# EAGLE design SLA_1500_CAM_V6 (EAGLE 9.2.1)
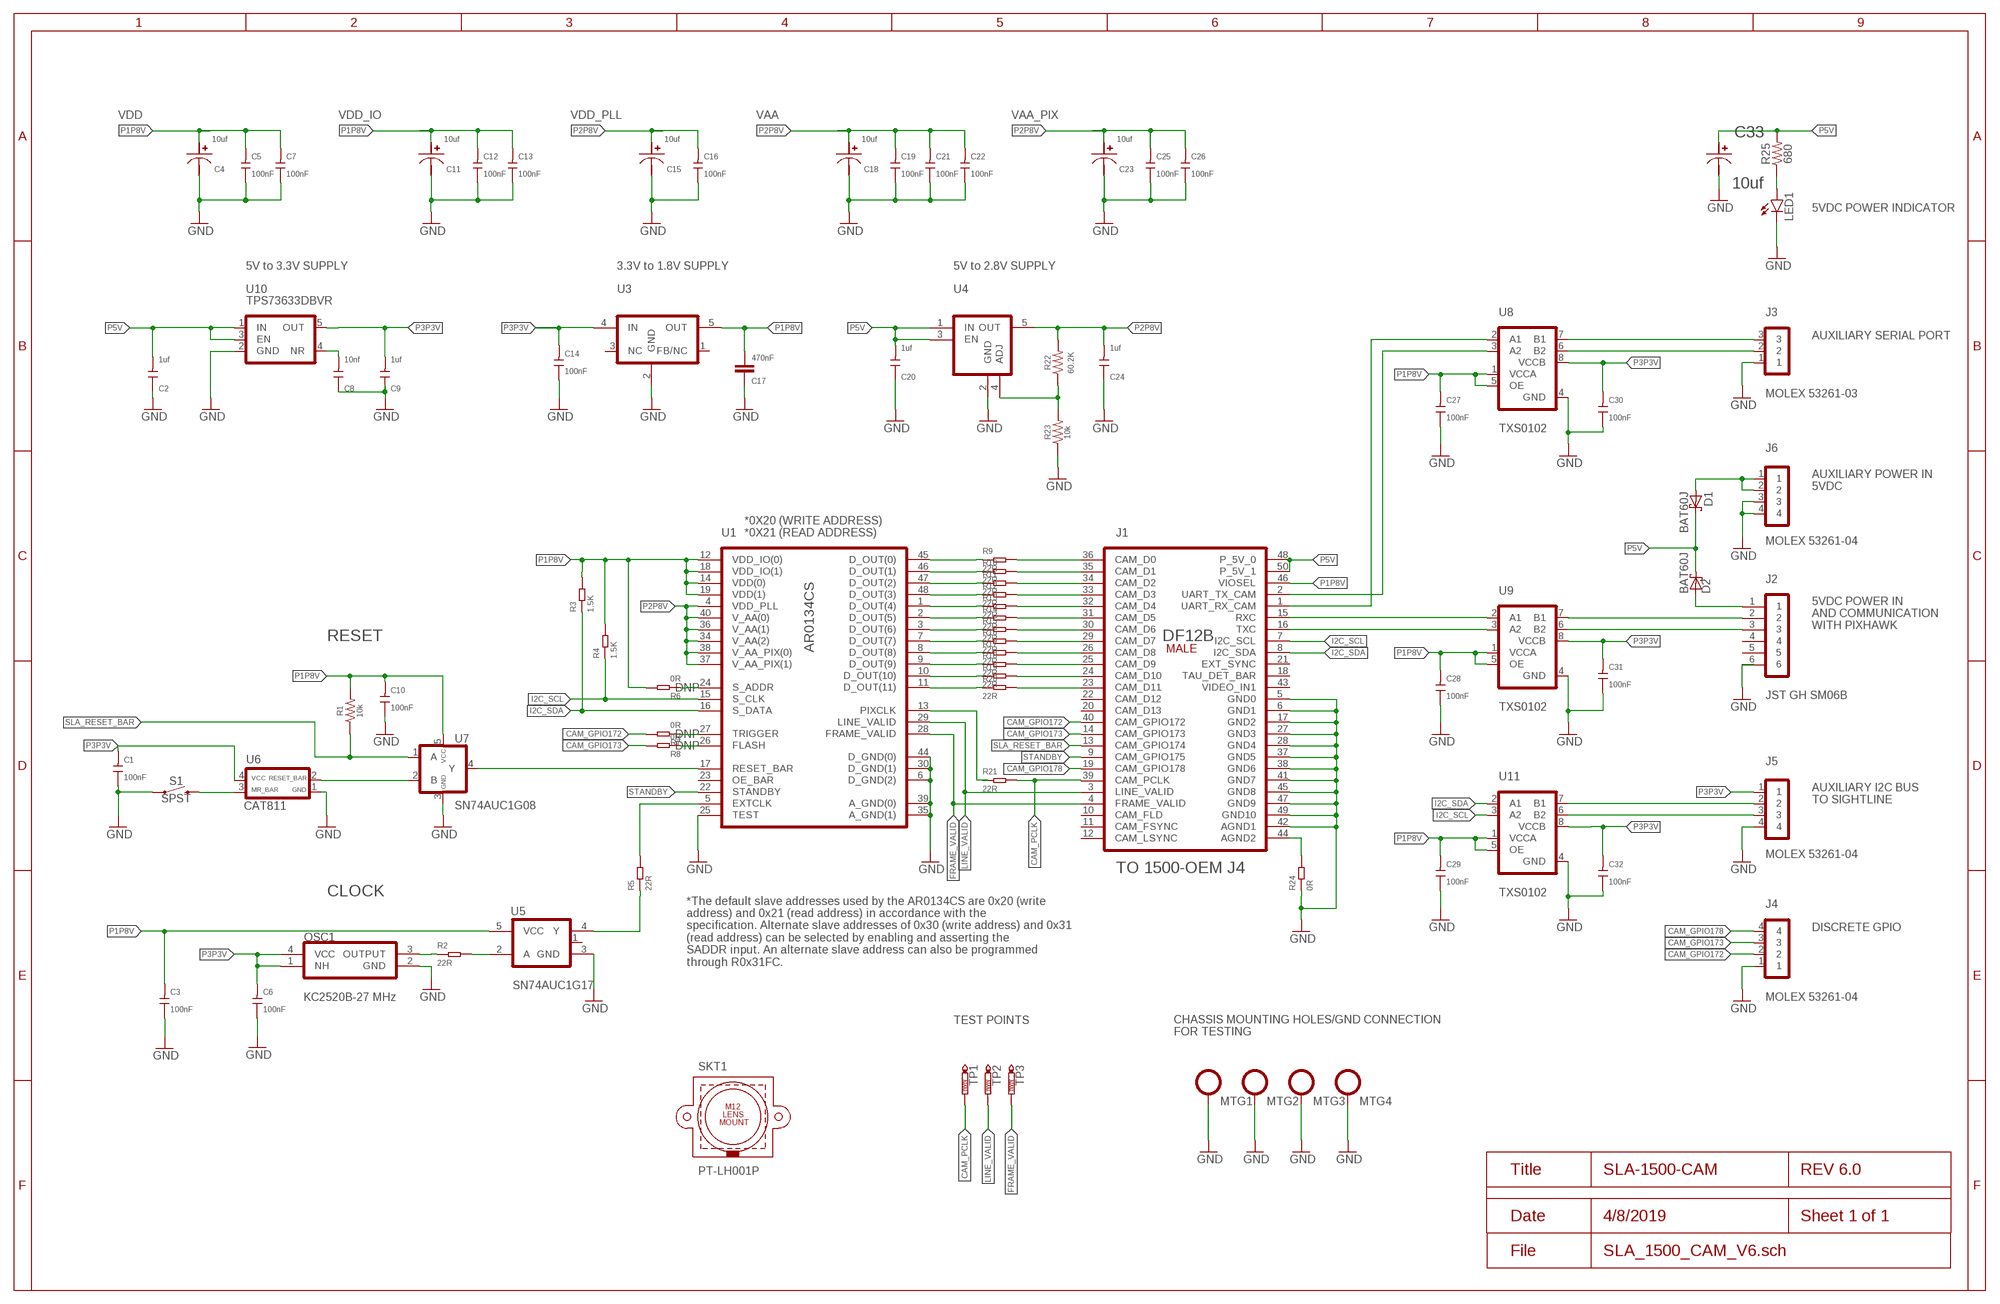
[diagram p0: schematic, sheet 1]
FRAME1 (FRAME_B_L): SPICEPREFIX: X

## Parts
C1  100nF  CERAMIC 100NF-10V-10%-X5R(0402)  [C0402]
C2  1uf  CERAMIC-1UF-10V-10%-X5R(0402)  [C0402]
C3  100nF  CERAMIC 100NF-10V-10%-X5R(0402)  [C0402]
C4  10uf  F980G106MUA  [0402]
C5  100nF  CERAMIC 100NF-10V-10%-X5R(0402)  [C0402]
C6  100nF  CERAMIC 100NF-10V-10%-X5R(0402)  [C0402]
C7  100nF  CERAMIC 100NF-10V-10%-X5R(0402)  [C0402]
C8  10nf  CERAMIC-10NF-50V-10%-X7R(0402)  [C0402]
C9  1uf  CERAMIC-1UF-10V-10%-X5R(0402)  [C0402]
C10  100nF  CERAMIC 100NF-10V-10%-X5R(0402)  [C0402]
C11  10uf  F980G106MUA  [0402]
C12  100nF  CERAMIC 100NF-10V-10%-X5R(0402)  [C0402]
C13  100nF  CERAMIC 100NF-10V-10%-X5R(0402)  [C0402]
C14  100nF  CERAMIC 100NF-10V-10%-X5R(0402)  [C0402]
C15  10uf  F980G106MUA  [0402]
C16  100nF  CERAMIC 100NF-10V-10%-X5R(0402)  [C0402]
C17  470nF  470NF-0402-16V-10%  [0402]
C18  10uf  F980G106MUA  [0402]
C19  100nF  CERAMIC 100NF-10V-10%-X5R(0402)  [C0402]
C20  1uf  CERAMIC-1UF-10V-10%-X5R(0402)  [C0402]
C21  100nF  CERAMIC 100NF-10V-10%-X5R(0402)  [C0402]
C22  100nF  CERAMIC 100NF-10V-10%-X5R(0402)  [C0402]
C23  10uf  F980G106MUA  [0402]
C24  1uf  CERAMIC-1UF-10V-10%-X5R(0402)  [C0402]
C25  100nF  CERAMIC 100NF-10V-10%-X5R(0402)  [C0402]
C26  100nF  CERAMIC 100NF-10V-10%-X5R(0402)  [C0402]
C27  100nF  CERAMIC 100NF-10V-10%-X5R(0402)  [C0402]
C28  100nF  CERAMIC 100NF-10V-10%-X5R(0402)  [C0402]
C29  100nF  CERAMIC 100NF-10V-10%-X5R(0402)  [C0402]
C30  100nF  CERAMIC 100NF-10V-10%-X5R(0402)  [C0402]
C31  100nF  CERAMIC 100NF-10V-10%-X5R(0402)  [C0402]
C32  100nF  CERAMIC 100NF-10V-10%-X5R(0402)  [C0402]
C33  10uf  F980J106MUALZT  [0402]
D1  BAT60J  [SOD323_ST]
D2  BAT60J  [SOD323_ST]
J1  DF12B(5.0)-50DS-0.5(86)SMT  [DF12B(5.0)-50DS-0.5V(86)]
J2  JST GH SM06B  JST_GH_SM06B-GHS-TB  [JST_SM06B-GHS-TB]
J3  MOLEX 53261-03  MOLEX53261-03  [53261-03]
J4  MOLEX 53261-04  MOLEX53261-04  [53261-04]
J5  MOLEX 53261-04  MOLEX53261-04  [53261-04]
J6  MOLEX 53261-04  MOLEX53261-04  [53261-04]
LED1  LEDCHIP-LED0603  [CHIP-LED0603]
MTG1  SLA_MOUNTING  [SLA_MOUNTING]
MTG2  SLA_MOUNTING  [SLA_MOUNTING]
MTG3  SLA_MOUNTING  [SLA_MOUNTING]
MTG4  SLA_MOUNTING  [SLA_MOUNTING]
OSC1  KC2520B-27MHZ  [2.5X2.0_SMDCRYSTAL]
R1  10k  10KOHM-0603-1/10W-1%  [0603]
R2  22R  SMD-RES-22R-1%-1/16W(0402)  [R0402]
R3  1.5K  SMD-RES-1.5K-5%-1/16W(0402)  [R0402]
R4  1.5K  SMD-RES-1.5K-5%-1/16W(0402)  [R0402]
R5  22R  SMD-RES-22R-1%-1/16W(0402)  [R0402]
R6  0R  SMD-RES-0R-5%-1/16W(0402)  [R0402]
R7  0R  SMD-RES-0R-5%-1/16W(0402)  [R0402]
R8  0R  SMD-RES-0R-5%-1/16W(0402)  [R0402]
R9  22R  SMD-RES-22R-1%-1/16W(0402)  [R0402]
R10  22R  SMD-RES-22R-1%-1/16W(0402)  [R0402]
R11  22R  SMD-RES-22R-1%-1/16W(0402)  [R0402]
R12  22R  SMD-RES-22R-1%-1/16W(0402)  [R0402]
R13  22R  SMD-RES-22R-1%-1/16W(0402)  [R0402]
R14  22R  SMD-RES-22R-1%-1/16W(0402)  [R0402]
R15  22R  SMD-RES-22R-1%-1/16W(0402)  [R0402]
R16  22R  SMD-RES-22R-1%-1/16W(0402)  [R0402]
R17  22R  SMD-RES-22R-1%-1/16W(0402)  [R0402]
R18  22R  SMD-RES-22R-1%-1/16W(0402)  [R0402]
R19  22R  SMD-RES-22R-1%-1/16W(0402)  [R0402]
R20  22R  SMD-RES-22R-1%-1/16W(0402)  [R0402]
R21  22R  SMD-RES-22R-1%-1/16W(0402)  [R0402]
R22  60.2K  62KOHM-0603-1/10W-5%  [0603]
R23  10k  10KOHM-0603-1/10W-1%  [0603]
R24  0R  SMD-RES-0R-5%-1/16W(0402)  [R0402]
R25  680  680OHM-0603-1/10W-5%  [0603]
S1  SPST  MOMENTARY-SWITCH-SPST-SMD-4.6X2.8MM  [TACTILE_SWITCH_SMD_4.6X2.8MM]
SKT1  PT-LH001P  M12_LENS_MOUNT  [M12_HOLDER]
TP1  PTR1TP08SQ  [TP08SQ]
TP2  PTR1TP08SQ  [TP08SQ]
TP3  PTR1TP08SQ  [TP08SQ]
U1  AR0134CS-ILCC48  [ILCC48_KD]
U3  TPS71518DCKR  [TI-SC70-5]
U4  AP7331-WG-7  [SOT-25]
U5  SN74AUC1G17  [SOT23-5]
U6  CAT811  [SOT-143-4]
U7  SN74AUC1G08  [SOT23-5]
U8  TXS0102  TXS0102DQM  [X2SON(8)1.8X1.2MM]
U9  TXS0102  TXS0102DQM  [X2SON(8)1.8X1.2MM]
U10  TPS73633DBVR  [SOT23-5]
U11  TXS0102  TXS0102DQM  [X2SON(8)1.8X1.2MM]

## Nets
CAM_GPIO172: J1.40(CAM_GPIO172) J4.2 R7.2
CAM_GPIO173: J1.14(CAM_GPIO173) J4.3 R8.2
CAM_GPIO178: J1.19(CAM_GPIO178) J4.4
CAM_PCLK: J1.39(CAM_PCLK) R21.2 TP1.TP
FRAME_VALID: J1.4(FRAME_VALID) TP3.TP U1.28(FRAME_VALID)
GND: C1.1 C2.1 C3.1 C4.2 C5.1 C6.1 C7.1 C8.1 C9.1 C10.1 C11.2 C12.1 C13.1 C14.1 C15.2 C16.1 C17.2 C18.2 C19.1 C20.1 C21.1 C22.1 C23.2 C24.1 C25.1 C26.1 C27.1 C28.1 C29.1 C30.1 C31.1 C32.1 C33.2 J1.5(GND0) J1.6(GND1) J1.17(GND2) J1.27(GND3) J1.28(GND4) J1.37(GND5) J1.38(GND6) J1.41(GND7) J1.42(AGND1) J1.45(GND8) J1.47(GND9) J1.49(GND10) J2.6 J3.1 J4.1 J5.4 J6.3 J6.4 LED1.C MTG1.P$1 MTG2.P$1 MTG3.P$1 MTG4.P$1 OSC1.2(GND) R23.1 R24.1 S1.1 S1.2 U1.6(D_GND(2)) U1.25(TEST) U1.30(D_GND(1)) U1.35(A_GND(1)) U1.39(A_GND(0)) U1.44(D_GND(0)) U3.2(GND) U4.2(GND) U5.3(GND) U6.1(GND) U7.3(GND) U8.4(GND) U9.4(GND) U10.2(GND) U11.4(GND)
I2C_SCL: J1.7(I2C_SCL) R4.1 U1.15(S_CLK) U11.3(A2)
I2C_SDA: J1.8(I2C_SDA) R3.1 U1.16(S_DATA) U11.2(A1)
LINE_VALID: J1.3(LINE_VALID) TP2.TP U1.29(LINE_VALID)
N$1: J2.3 U9.6(B2)
N$2: R9.1 U1.45(D_OUT(0))
N$3: J1.36(CAM_D0) R9.2
N$4: R10.1 U1.46(D_OUT(1))
N$5: J1.35(CAM_D1) R10.2
N$6: R11.1 U1.47(D_OUT(2))
N$7: J1.34(CAM_D2) R11.2
N$8: R12.1 U1.48(D_OUT(3))
N$9: J1.33(CAM_D3) R12.2
N$10: R13.1 U1.1(D_OUT(4))
N$11: J1.32(CAM_D4) R13.2
N$12: R14.1 U1.2(D_OUT(5))
N$13: J3.3 U8.7(B1)
N$14: J1.31(CAM_D5) R14.2
N$15: R2.2 U5.2(A)
N$16: OSC1.3(OUTPUT) R2.1
N$17: J2.2 U9.7(B1)
N$18: J3.2 U8.6(B2)
N$19: J1.1(UART_RX_CAM) U8.2(A1)
N$20: J1.2(UART_TX_CAM) U8.3(A2)
N$21: C8.2 U10.4(NR)
N$22: R15.1 U1.3(D_OUT(6))
N$23: R22.1 R23.2 U4.4(ADJ)
N$24: J1.30(CAM_D6) R15.2
N$25: R5.1 U5.4(Y)
N$26: R5.2 U1.5(EXTCLK)
N$27: S1.3 S1.4 U6.3(MR_BAR)
N$28: U6.2(RESET_BAR) U7.2(B)
N$29: U1.17(RESET_BAR) U7.4(Y)
N$30: LED1.A R25.1
N$31: J1.44(AGND2) R24.2
N$32: R7.1 U1.27(TRIGGER)
N$33: R8.1 U1.26(FLASH)
N$34: D2.A J2.1
N$35: J1.15(RXC) U9.2(A1)
N$36: J1.16(TXC) U9.3(A2)
N$37: J5.2 U11.7(B1)
N$38: J5.3 U11.6(B2)
N$39: D1.A J6.1 J6.2
N$40: R16.1 U1.7(D_OUT(7))
N$41: J1.29(CAM_D7) R16.2
N$42: R17.1 U1.8(D_OUT(8))
N$43: J1.26(CAM_D8) R17.2
N$44: R18.1 U1.9(D_OUT(9))
N$45: J1.25(CAM_D9) R18.2
N$46: R19.1 U1.10(D_OUT(10))
N$47: J1.24(CAM_D10) R19.2
N$48: R20.1 U1.11(D_OUT(11))
N$49: J1.23(CAM_D11) R20.2
N$52: R6.1 U1.24(S_ADDR)
P1P8V: C3.2 C4.1 C5.2 C7.2 C10.2 C11.1 C12.2 C13.2 C17.1 C27.2 C28.2 C29.2 J1.46(VIOSEL) R1.2 R3.2 R4.2 R6.2 U1.12(VDD_IO(0)) U1.14(VDD(0)) U1.18(VDD_IO(1)) U1.19(VDD(1)) U3.5(OUT) U5.5(VCC) U7.5(VCC) U8.1(VCCA) U8.5(OE) U9.1(VCCA) U9.5(OE) U11.1(VCCA) U11.5(OE)
P2P8V: C15.1 C16.2 C18.1 C19.2 C21.2 C22.2 C23.1 C24.2 C25.2 C26.2 R22.2 U1.4(VDD_PLL) U1.34(V_AA(2)) U1.36(V_AA(1)) U1.37(V_AA_PIX(1)) U1.38(V_AA_PIX(0)) U1.40(V_AA(0)) U4.5(OUT)
P3P3V: C1.2 C6.2 C9.2 C14.2 C30.2 C31.2 C32.2 J5.1 OSC1.1(NH) OSC1.4(VCC) U3.4(IN) U6.4(VCC) U8.8(VCCB) U9.8(VCCB) U10.5(OUT) U11.8(VCCB)
P5V: C2.2 C20.2 C33.1 D1.C D2.C J1.48(P_5V_0) J1.50(P_5V_1) R25.2 U4.1(IN) U4.3(EN) U10.1(IN) U10.3(EN)
PIXCLK: R21.1 U1.13(PIXCLK)
SLA_RESET_BAR: J1.13(CAM_GPIO174) R1.1 U7.1(A)
STANDBY: J1.9(CAM_GPIO175) U1.22(STANDBY)
Unconnected: J1.10(CAM_FLD) J1.11(CAM_FSYNC) J1.12(CAM_LSYNC) J1.18(TAU_DET_BAR) J1.20(CAM_D13) J1.21(EXT_SYNC) J1.22(CAM_D12) J1.43(VIDEO_IN1) J2.4 J2.5 U1.23(OE_BAR) U3.1(FB/NC) U3.3(NC) U5.1(NC)

## Notes on the sheet
- VDD | VDD_IO | VDD_PLL | VAA | VAA_PIX
- 5VDC POWER INDICATOR
- 5V to 3.3V SUPPLY | 3.3V to 1.8V SUPPLY | 5V to 2.8V SUPPLY
- AUXILIARY SERIAL PORT
- AUXILIARY POWER IN
  5VDC
- *0X20 (WRITE ADDRESS)
  *0X21 (READ ADDRESS)
- 5VDC POWER IN 
  AND COMMUNICATION 
  WITH PIXHAWK
- RESET
- DNP
- DNP
- DNP
- AUXILIARY I2C BUS 
  TO SIGHTLINE
- TO 1500-OEM J4
- CLOCK
- DISCRETE GPIO
- *The default slave addresses used by the AR0134CS are 0x20 (write
  address) and 0x21 (read address) in accordance with the
  specification. Alternate slave addresses of 0x30 (write address) and 0x31 
  (read address) can be selected by enabling and asserting the
  SADDR input. An alternate slave address can also be programmed
  through R0x31FC.
- TEST POINTS
- CHASSIS MOUNTING HOLES/GND CONNECTION
  FOR TESTING

## Library data of the parts
C1 C3 C5-C7 C10 C12-C14 C16 C19 C21 C22 C25-C32 = Seeed-Capacitor:CERAMIC 100NF-10V-10%-X5R(0402): 302010037; MPN: CC0402KRX5R6BB104; VALUE: 100NF 10V
C2 C9 C20 C24 = Seeed-Capacitor:CERAMIC-1UF-10V-10%-X5R(0402): 302010040; MPN: CC0402KRX5R6BB105
C4 C11 C15 C18 C23 = Sightline:F980G106MUA: F980G106MUA Tantalum Capacitors - Solid SMD 10uF 4V 20% 0402, 1.1x0.6x0.35mm F98 SERIES DATASHEET <https://www.mouser.com/datasheet/2/40/f98-775787.pdf>; DESCRIPTION: Tantalum Capacitors - Solid SMD 10uF 4V 20% 0402, 1.1x0.6x0.35mm; MANF: AVX; MANF#: F980G106MUA
C8 = Seeed-Capacitor:CERAMIC-10NF-50V-10%-X7R(0402): 302010006; MPN: CC0402KRX7R9BB103
C17 = SparkFun-Capacitors:470NF: 0.47uF/470nF ceramic capacitors A capacitor is a passive two-terminal electrical component used to store electrical energy temporarily in an electric field.; PROD_ID: CAP-09041
C33 = Sightline:F980J106MUALZT: F980G106MUALZT Tantalum Capacitors - Solid SMD 10uF 6.3V 20% 0402, 1.1x0.6x0.35mm F98 SERIES DATASHEET <https://www.mouser.com/datasheet/2/40/f98-775787.pdf>; DESCRIPTION: Tantalum Capacitors - Solid SMD 10uF 6.3V 20% 0402, 1.1x0.6x0.35mm; MANF: AVX; MANF#: F980J106MUALZT
D1 D2 = diode:BAT60J: Schottky barrier diode Source: www.st.com, BAT60J.pdf
J1 = Sightline:DF12B(5.0)-50DS-0.5(86): DF12B(5.0)-50DS-0.5(86) DF12 Series 0.5 mm Pitch SMT Board-to-Board Connector (MALE) Specifications Manufacturer: Hirose Manufacturer Part Number: 537-0309-6 86 Operating Temperature Range(C): -45 - 125 Current Rating: 0.3A Voltage Rating: 50V AC Body Size(mm): 14.6 x 3.6 DF12B(5.0)-50DS DATASHEET <https://www.hirose.com/product/en/products/DF12/> Created by: Kimball S. Davis kimball4@pdx.edu <mailto: kimball4@pdx.edu> 21 January 2019 Version 001; DESCRIPTION: DF12B-50DS-0.5V(86) Hirose Male 50-pin connector; MANF: Hirose; MANF#: 537-0309-6 86
J2 = Sightline:JST_GH_SM06B-GHS-TB: JST SM06B-GHS-TB JST Type GH 1.25mm side-entry smt 6-pin connector Specifications Manufacturer: JST Manufacturer Part Number: SM06B-GHS-TB Body Size(mm): 10.75 X 4.25 JST TYPE GH DATASHEET <http://www.jst-mfg.com/product/pdf/eng/eGH.pdf> Created by: Kimball S. Davis 5 February 2019 Version 001; DESCRIPTION: 1.25 MM SIDE-ENTRY 6-PIN SMT CONNECTOR; MANF: JST; MANF#: SM06B-GHS-TB
J3 = Sightline:MOLEX53261-03: MOLEX 53261-03 1.25mm Pitch PicoBlade Header, Surface Mount, Right-Angle, 3 Circuits, Tin (Sn) Plating 53261-03 DATASHEET <https://www.molex.com/webdocs/datasheets/pdf/en-us/0532610371_PCB_HEADERS.pdf>; DESCRIPTION: 1.25mm Pitch PicoBlade Header, Surface Mount, Right-Angle, 3 Circuits, Tin (Sn) Plating; MANF: MOLEX; MANF#: 532610371
J4-J6 = Sightline:MOLEX53261-04: MOLEX 53261-04 1.25mm Pitch PicoBlade Header, Surface Mount, Right-Angle, 4 Circuits, Tin (Sn) Plating 53261-04 DATASHEET <https://www.molex.com/webdocs/datasheets/pdf/en-us/0532610471_PCB_HEADERS.pdf>; DESCRIPTION: 1.25mm Pitch PicoBlade Header, Surface Mount, Right-Angle, 4 Circuits, Tin (Sn) Plating; MANF: MOLEX; MANF#: 532610471
LED1 = led:LED: LED OSRAM: - CHIPLED LG R971, LG N971, LY N971, LG Q971, LY Q971, LO R971, LY R971 LH N974, LH R974 LS Q976, LO Q976, LY Q976 LO Q996 - Hyper CHIPLED LW Q18S LB Q993, LB Q99A, LB R99A - SideLED LS A670, LO A670, LY A670, LG A670, LP A670 LB A673, LV A673, LT A673, LW A673 LH A674 LY A675 LS A676, LA A676, LO A676, LY A676, LW A676 LS A679, LY A679, LG A679 - Hyper Micro SIDELED® LS Y876, LA Y876, LO Y876, LY Y876 LT Y87S - SmartLED LW L88C, LW L88S LB L89C, LB L89S, LG L890 LS L89K, LO L89K, LY L89K LS L896, LA L896, LO L896, LY L896 - TOPLED LS T670, LO T670, LY T670, LG T670, LP T670 LSG T670, LSP T670, LSY T670, LOP T670, LYG T670 LG T671, LOG T671, LSG T671 LB T673, LV T673, LT T673, LW T673 LH T674 LS T676, LA T676, LO T676, LY T676, LB T676, LH T676, LSB T676, LW T676 LB T67C, LV T67C, LT T67C, LS T67K, LO T67K, LY T67K, LW E67C LS E67B, LA E67B, LO E67B, LY E67B, LB E67C, LV E67C, LT E67C LW T67C LS T679, LY T679, LG T679 LS T770, LO T770, LY T770, LG T770, LP T770 LB T773, LV T773, LT T773, LW T773 LH T774 LS E675, LA E675, LY E675, LS T675 LS T776, LA T776, LO T776, LY T776, LB T776 LHGB T686 LT T68C, LB T68C - Hyper Mini TOPLED® LB M676 - Mini TOPLED Santana® LG M470 LS M47K, LO M47K, LY M47K Source: http://www.osram.convergy.de LUXEON: - LUMILED® LXK2-PW12-R00, LXK2-PW12-S00, LXK2-PW14-U00, LXK2-PW14-V00 LXK2-PM12-R00, LXK2-PM12-S00, LXK2-PM14-U00 LXK2-PE12-Q00, LXK2-PE12-R00, LXK2-PE12-S00, LXK2-PE14-T00, LXK2-PE14-U00 LXK2-PB12-K00, LXK2-PB12-L00, LXK2-PB12-M00, LXK2-PB14-N00, LXK2-PB14-P00, LXK2-PB14-Q00 LXK2-PR12-L00, LXK2-PR12-M00, LXK2-PR14-Q00, LXK2-PR14-R00 LXK2-PD12-Q00, LXK2-PD12-R00, LXK2-PD12-S00 LXK2-PH12-R00, LXK2-PH12-S00 LXK2-PL12-P00, LXK2-PL12-Q00, LXK2-PL12-R00 Source: www.luxeon.com KINGBRIGHT: KA-3528ASYC Source: www.kingbright.com
MTG1-MTG4 = Sightline:SLA_MOUNTING
OSC1 = Sightline:KC2520B-27MHZ: KC2520B-27MHz-2.5X2.0 27 MHz SMT Clock Oscillator with CMOS output Specifications Manufacturer: Kyocera Manufacturer Part Number: KC2520B27.0000C2GE00 Supply Voltage: 1.8 to 3.3V Body Size(mm): 2.5 x 2.0 KC2520B DATASHEET <https://www.mouser.com/datasheet/2/909/kc2520b_c1_e-1388834.pdf> Created by: Kimball S. Davis 25 January 2019 Version 001; DESCRIPTION: OSC, CRYSTAL CLOCK, SMD, CMOS, 2.25V TO 3.63V, 4mA, 27.0000MHz, 2.5MM x 2.0MM; MANF: Kyocera; MANF#: KC2520B27.0000C2GE00
R1 R23 = SparkFun-Resistors:10KOHM: 10kΩ resistor A resistor is a passive two-terminal electrical component that implements electrical resistance as a circuit element. Resistors act to reduce current flow, and, at the same time, act to lower voltage levels within circuits. - Wikipedia; PROD_ID: RES-00824
R2 R5 R9-R21 = Seeed-Resistor:SMD-RES-22R-1%-1/16W(0402): 301010052; MPN: RC0402FR-0722RL
R3 R4 = Seeed-Resistor:SMD-RES-1.5K-5%-1/16W(0402): 301010001; MPN: RC0402JR-071K5L
R6-R8 R24 = Seeed-Resistor:SMD-RES-0R-5%-1/16W(0402): 301010000; MPN: RC0402JR-070RL
R22 = SparkFun-Resistors:62KOHM: 62kΩ resistor A resistor is a passive two-terminal electrical component that implements electrical resistance as a circuit element. Resistors act to reduce current flow, and, at the same time, act to lower voltage levels within circuits. - Wikipedia
R25 = SparkFun-Resistors:680OHM: 680Ω resistor A resistor is a passive two-terminal electrical component that implements electrical resistance as a circuit element. Resistors act to reduce current flow, and, at the same time, act to lower voltage levels within circuits. - Wikipedia; PROD_ID: RES-09333
S1 = SparkFun-Switches:MOMENTARY-SWITCH-SPST: Momentary Switch (Pushbutton) - SPST Normally-open (NO) SPST momentary switches (buttons, pushbuttons). Variants PTH-12MM - 12mm square, through-hole Momentary Pushbutton Switch - 12mm Square <https://www.sparkfun.com/products/9190> (COM-09190) PTH-6.0MM, PTH-6.0MM-KIT - 6.0mm square, through-hole Mini Pushbutton Switch <https://www.sparkfun.com/products/97> (COM-00097) KIT package intended for soldering kit's - only one side of pads' copper is exposed. PTH-RIGHT-ANGLE-KIT - Right-angle, through-hole Right Angle Tactile Button <https://www.sparkfun.com/products/10791> - Used on SparkFun BigTime Watch Kit <https://www.sparkfun.com/products/11734> SMD-12MM - 12mm square, surface-mount Tactile Button - SMD (12mm) <https://www.sparkfun.com/products/12993> (COM-12993) Used on SparkFun PicoBoard <https://www.sparkfun.com/products/11888> SMD-4.5MM - 4.5mm Square Trackball Switch Used on SparkFun Blackberry Trackballer Breakout <https://www.sparkfun.com/products/13169> SMD-4.6MMX2.8MM - 4.60mm x 2.80mm, surface mount Used on SparkFun SAMD21 Mini Breakout <https://www.sparkfun.com/products/13664> SMD-5.2MM, SMD-5.2-REDUNDANT - 5.2mm square, surface-mount Mini Pushbutton Switch - SMD <https://www.sparkfun.com/products/8720> (COM-08720) Used on Arduino Pro Mini <https://www.sparkfun.com/products/11114> REDUNDANT package connects both switch circuits together SMD-6.0X3.5MM - 6.0 x 3.5mm, surface mount Momentary Reset Switch SMD <https://www.sparkfun.com/products/8229> (COM-08229) SMD-6.2MM-TALL - 6.2mm square, surface mount Tactile Button - SMD (6mm) <https://www.sparkfun.com/products/12992> Used on SparkFun Digital Sandbox <https://www.sparkfun.com/products/12651> SMD-RIGHT-ANGLE - Right-angle, surface mount Used on SparkFun Block for Intel® Edison - Arduino <https://www.sparkfun.com/products/13036>; PROD_ID: SWCH-13065
SKT1 = Sightline:M12_LENS_MOUNT: PT-LH001P PT-LH001P Plastic M12 Lens Holder, 20mm Hole Spacing; DESCRIPTION: PT-LH001P Plastic M12 Lens Holder, 20mm Hole Spacing; MANF: M12 LENSES; MANF#: PT-LH001P
TP1-TP3 = testpad:PTR1: TEST PIN
U1 = Sightline:AR0134CS-ILCC48: AR0134CS-1LCC48-10x10 1/3-inch 1.2 Mp CMOS digital image sensor with an active-pixel array of 1280 (H) × 960 (V) Specifications Manufacturer: On Semiconductor Manufacturer Part Number: AR0134CSSM00SPCA0 Operating Temperature Range(C): -30 - 70 Supply Voltage: I/O: 1.8 or 2.8V Digital: 1.8V Analog: 2.8V HiSPi: 0.4V Body Size(mm): 10 x 10 ARO134CS DATASHEET <https://www.onsemi.com/pub/Collateral/AR0134CS-D.PDF> Created by: Kimball S. Davis kimball4@pdx.edu <mailto: kimball4@pdx.edu> 22 January 2019 Version 001; DESCRIPTION: 1/3-inch 1.2 Mp CMOS digital image sensor with an active-pixel array of 1280 (H) × 960 (V); MANF: On Semiconductor; MANF#: AR0134CSSM00SPCA0
U3 = Sightline:TPS71518DCKR: TPS71518DCKR 50-mA, 24-V, 3.2-μA Supply Current Low-Dropout Linear Regulator in SC70 5-Pin Package, 3.3 to 1.8V, 2.15 x 1.4mm TPS71518DCKR DATASHEET <http://www.ti.com/lit/ds/symlink/tps715.pdf>; DESCRIPTION: 50-mA, 24-V, 3.2-μA Supply Current Low-Dropout Linear Regulator in SC70 5-Pin Package, 3.3 to 1.8V, 2.15 x 1.4mm; MANF: TEXAS INSTRUMENTS; MANF#: TPS71518DCKR
U4 = Sightline:AP7331-WG-7: AP7331-WG-7 300mA, LOW QUIESCENT CURRENT, FAST TRANSIENT LOW DROPOUT LINEAR REGULATOR, ADJUSTABLE OUTPUT, 5V to 2.8V, 3.1 x 1.7mm AP7331 DATASHEET <https://www.diodes.com/assets/Datasheets/AP7331.pdf>; DESCRIPTION: 300mA, LOW QUIESCENT CURRENT, FAST TRANSIENT LOW DROPOUT LINEAR REGULATOR, ADJUSTABLE OUTPUT, 5V to 2.8V, 3.1 x 1.7mm; MANF: DIODES INCORPORATED; MANF#: AP7331-WG-7
U5 = Sightline:SN74AUC1G17: SN74AUC1G17-SOT23-5 IC, BUFFER, SINGLE SCHMITT-TRIGGER, 9mA, 0.8V TO 2.7V, SOT23-5 Specifications Manufacturer: Texas Instruments Manufacturer Part Number: SN74AUC1G17DBVR Supply Voltage: 3.6V Max Body Size(mm): 2.9 x 1.6 SN74AUC1G17 DATASHEET <http://www.ti.com/lit/ds/symlink/sn74auc1g17.pdf> Created by: Kimball S. Davis 24 January 2019 Version 001; DESCRIPTION: IC, BUFFER, SINGLE SCHMITT-TRIGGER, 9mA, 0.8V TO 2.7V, SOT23-5; MANF: TEXAS INSTRUMENTS; MANF#: SN74AUC1G17DBV
U6 = Sightline:CAT811: CAT811-SOT-143-4 IC, SUPERVISOR, MICROPROCESSOR POWER SUPPLY, 2.93V, ACTIVE LOW RESET, SOT143-4 Specifications Manufacturer: On Semiconductor Manufacturer Part Number: CAT811STBI Body Size(mm): 2.9 x 1.3 CAT811 DATASHEET <https://www.onsemi.com/pub/Collateral/CAT811-D.PDF> Created by: Kimball S. Davis 23 January 2019 Version 001; DESCRIPTION: IC, SUPERVISOR, MICROPROCESSOR POWER SUPPLY, 2.93V, ACTIVE LOW RESET, SOT143-4; MANF: On Semiconductor; MANF#: CAT811STBI
U7 = Sightline:SN74AUC1G08: SN74AUC1G08-SOT23-5 Single 2-Input Positive-AND Gate Specifications Manufacturer: Texas Instruments Manufacturer Part Number: SN74AUC1G08DBVR Supply Voltage: 1.65 - 1.95V Body Size(mm): 2.9 x 1.6 SN74AUC1G08 DATASHEET <http://www.ti.com/lit/ds/symlink/sn74auc1g08.pdf>; DESCRIPTION: IC, AND GATE, SINGLE, 2 INPUT POSITIVE, SGL, SOT23-5; MANF: Texas Instruments; MANF#: SN74AUC1G08DBVR
U8 U9 U11 = Sightline:TXS0102DQM: TXS0102DQM 1.8 X 1.2 mm TXS0102 2-Bit Bidirectional Voltage-Level Translator TXS0102 DATASHEET <http://www.ti.com/lit/ds/symlink/txs0102.pdf>; DESCRIPTION: TXS0102 2-Bit Bidirectional Voltage-Level Translator for Open-Drain and Push-Pull Applications; MANF: Texas Instruments; MANF#: TXS0102DQM
U10 = Sightline:TPS73633DBVR: TPS73633DBVR Cap-Free, NMOS, 400-mA Low-Dropout Regulator with Reverse Current Protection 5.5 to 3.3V, SOT-23 5-pin, 2.9 x 1.6 mm TPS73633DBVR DATASHEET <http://www.ti.com/lit/ds/symlink/tps736.pdf>; DESCRIPTION: Cap-Free, NMOS, 400-mA Low-Dropout Regulator with Reverse Current Protection 5.5 to 3.3V, SOT-23 5-pin, 2.9 x 1.6 mm; MANF: Texas Instruments; MANF#: TPS73633DBVR

## Board
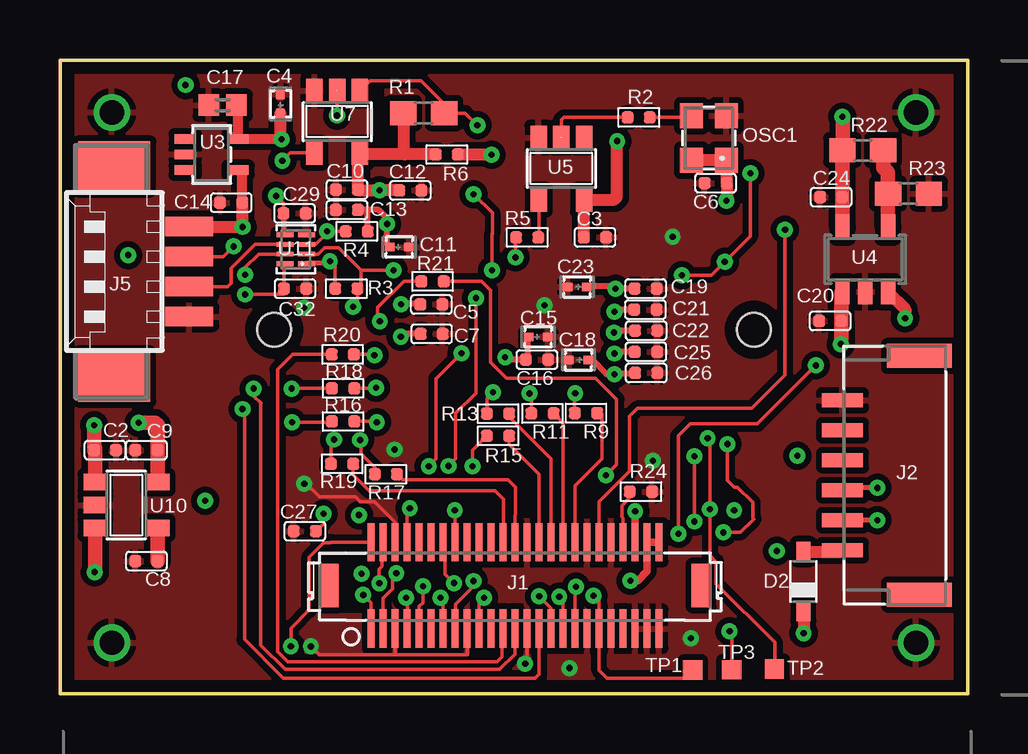
[diagram p1: board, top side]
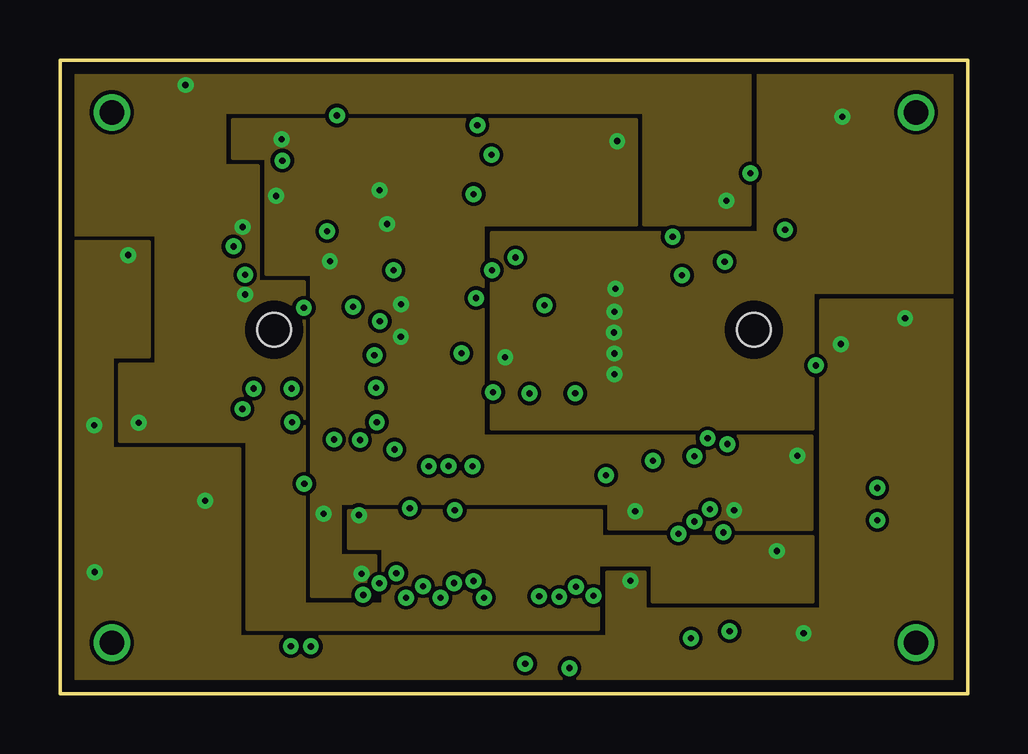
[diagram p2: board, inner layer Route2]
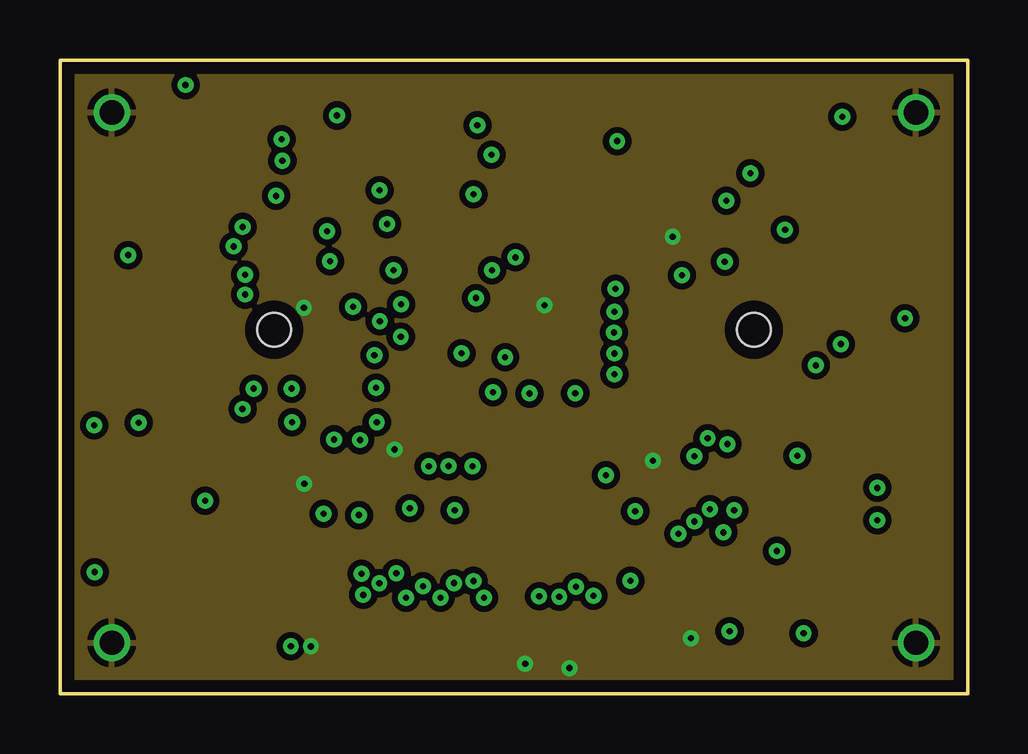
[diagram p3: board, inner layer Route15]
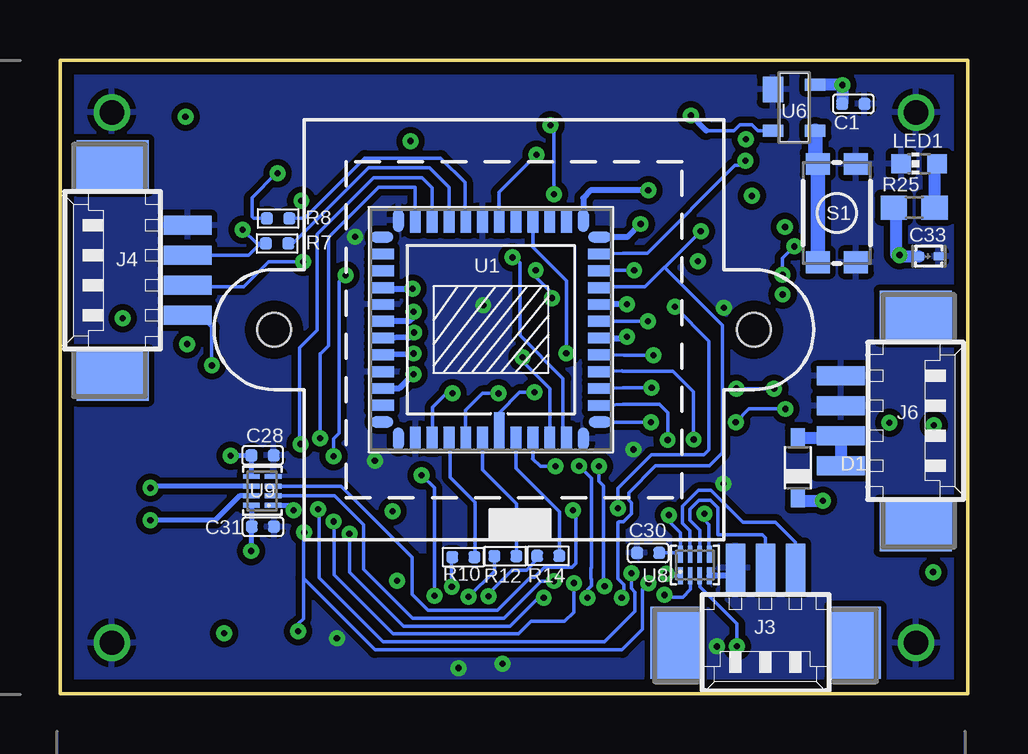
[diagram p4: board, bottom side, seen from below]

Size 37.85 x 26.42 mm. Coordinates in mm from the lower left corner, seen from the top.
Outline: 0,0 0.18,0
Outline: 0.18,0 37.85,0 37.85,26.42 0,26.42 0,0
Outline: 0,0 0.18,0
Copper layers (1+2*15+16): Top 0.0178mm / dielectric 12mil / Route2 0.0356mm / dielectric 28mil / Route15 0.0356mm / dielectric 12mil / Bottom 0.0178mm
Design rules "SSC-EAGLE-4Lyr_v1.0.0.3 *": minimum track width 6mil, minimum drill 8mil, track to track 6mil, track to pad 6mil, pad to pad 6mil, via to via 6mil, smd to smd 6mil, copper to edge 20mil, drill to drill 16mil, minimum pad ring 8mil, minimum via ring 8mil, stop-mask expansion 3mil, vias tented up to drill 12mil, thermal gap 10mil

### Footprints (pad centres in the part's own frame; a part is rotated, then mirrored left to right if it is on the bottom)
C0402 = smd 0.5 x 0.5: 1 0,0.463; 2 0,-0.463
0402 = smd 0.4 x 0.35: 1 -0.4,0; 2 0.4,0
0402' = smd 0.85 x 0.9: 1 -0.58,0; 2 0.58,0
SOD323_ST = smd 0.8 x 0.6: A 1.25,0; C -1.25,0
DF12B(5.0)-50DS-0.5V(86) = smd 1.6 x 0.3: 1 -0.001,12; 2 3.599,12; 3 -0.001,11.5; 4 3.599,11.5; 5 -0.001,11; 6 3.599,11; 7 -0.001,10.5; 8 3.599,10.5; 9 -0.001,10; 10 3.599,10; 11 -0.001,9.5; 12 3.599,9.5; 13 -0.001,9; 14 3.599,9; 15 -0.001,8.5; 16 3.599,8.5; 17 -0.001,8; 18 3.599,8; 19 -0.001,7.5; 20 3.599,7.5; 21 -0.001,7; 22 3.599,7; 23 -0.001,6.5; 24 3.599,6.5; 25 -0.001,6; 26 3.599,6; 27 -0.001,5.5; 28 3.599,5.5; 29 -0.001,5; 30 3.599,5; 31 -0.001,4.5; 32 3.599,4.5; 33 -0.001,4; 34 3.599,4; 35 -0.001,3.5; 36 3.599,3.5; 37 -0.001,3; 38 3.599,3; 39 -0.001,2.5; 40 3.599,2.5; 41 -0.001,2; 42 3.599,2; 43 -0.001,1.5; 44 3.599,1.5; 45 -0.001,1; 46 3.599,1; 47 -0.001,0.5; 48 3.599,0.5; 49 -0.001,0; 50 3.599,0 | smd 1.8 x 0.8: P$51 1.799,13.75; P$52 1.799,-1.75
JST_SM06B-GHS-TB = smd 0.6 x 1.7: 1 -3.23,1.95; 2 -1.98,1.95; 3 -0.73,1.95; 4 0.52,1.95; 5 1.77,1.95; 6 3.02,1.95 | smd 1 x 2.7: P$7 -5.08,-1.25; P$8 4.87,-1.25
53261-03 = smd 0.8 x 2: 1 1.25,-2.5; 2 0,-2.5; 3 -1.25,-2.5 | smd 2.1 x 3: S1 3.75,0.625; S2 -3.75,0.625
53261-04 = smd 0.8 x 2: 1 1.875,-2.5; 2 0.625,-2.5; 3 -0.625,-2.5; 4 -1.875,-2.5 | smd 2.1 x 3: S1 4.375,0.625; S2 -4.375,0.625
CHIP-LED0603 = smd 0.8 x 0.8: A 0,-0.75; C 0,0.75
SLA_MOUNTING = drill 1.016: P$1 0,0
2.5X2.0_SMDCRYSTAL = smd 1.05 x 0.95: 1 -0.925,-0.725; 2 0.925,-0.725; 3 0.925,0.725; 4 -0.925,0.725
0603 = smd 1.1 x 1: 1 -0.85,0; 2 0.85,0
R0402 = smd 0.5 x 0.5: 1 0,0.463; 2 0,-0.463
TACTILE_SWITCH_SMD_4.6X2.8MM = smd 0.9 x 1: 1 -2.05,-0.8; 2 2.05,-0.8; 3 2.05,0.8; 4 -2.05,0.8
M12_HOLDER = hole 1.4: -10,0; 10,0
TP08SQ = smd 0.8 x 0.8: TP 0,0
ILCC48_KD = smd 0.45 x 1.6: 1 -0.35,4.238 | smd 0.45 x 1: 2 -1.05,4.538; 3 -1.75,4.538; 4 -2.45,4.538; 5 -3.15,4.538; 20 -3.15,-4.538; 21 -2.45,-4.538; 22 -1.75,-4.538; 23 -1.05,-4.538; 24 -0.35,-4.538; 25 0.35,-4.538; 26 1.05,-4.538; 27 1.75,-4.538; 28 2.45,-4.538; 29 3.15,-4.538; 44 3.15,4.538; 45 2.45,4.538; 46 1.75,4.538; 47 1.05,4.538; 48 0.35,4.538 | smd 0.45 x 0.95: 6 -3.85,4.55; 19 -3.85,-4.55; 30 3.85,-4.55; 43 3.85,4.55 | smd 0.95 x 0.45: 7 -4.55,3.85; 18 -4.537,-3.85; 31 4.55,-3.85; 42 4.551,3.85 | smd 1 x 0.45: 8 -4.538,3.163; 9 -4.538,2.45; 10 -4.538,1.75; 11 -4.538,1.05; 12 -4.538,0.35; 13 -4.538,-0.35; 14 -4.538,-1.05; 15 -4.538,-1.75; 16 -4.538,-2.45; 17 -4.538,-3.15; 32 4.538,-3.15; 33 4.538,-2.45; 34 4.538,-1.75; 35 4.538,-1.05; 36 4.538,-0.35; 37 4.538,0.35; 38 4.538,1.05; 39 4.538,1.75; 40 4.538,2.45; 41 4.538,3.15
TI-SC70-5 = smd 0.4 x 0.9: 1 -0.65,-1.1; 2 0,-1.1; 3 0.65,-1.1; 4 0.65,1.1; 5 -0.65,1.1
SOT-25 = smd 0.6 x 1.05: 1 -0.95,-1.35; 2 0,-1.35; 3 0.95,-1.35; 4 0.95,1.35; 5 -0.95,1.35
SOT23-5 = smd 0.69 x 0.99: 1 -0.95,-1.29; 2 0,-1.29; 3 0.95,-1.29; 4 0.95,1.3; 5 -0.95,1.3
SOT-143-4 = smd 1.06 x 0.85: 1 -0.76,-0.88 | smd 0.5 x 0.85: 2 0.96,-0.88; 3 0.96,0.88; 4 -0.96,0.88
X2SON(8)1.8X1.2MM = smd 0.2 x 0.7: 1 -0.6,-0.45; 2 -0.2,-0.45; 3 0.2,-0.45; 4 0.6,-0.45; 5 0.6,0.45; 6 0.2,0.45; 7 -0.2,0.45; 8 -0.6,0.45

### Placement (x,y rotation side)
C1  4.78,24.59 270 bottom
C2  1.88,10.16 270 top
C3  22.3,19.02 270 top
C4  9.19,24.59 90 top
C5  15.48,16.23 270 top
C6  27.33,21.29 90 top
C7  15.49,15 270 top
C8  3.61,5.54 90 top
C9  3.61,10.16 90 top
C10  11.96,21.02 90 top
C11  14.15,18.62 0 top
C12  14.6,20.98 270 top
C13  11.96,20.17 90 top
C14  7.14,20.47 90 top
C15  19.93,14.88 0 top
C16  19.88,13.93 270 top
C17  470nF  [0402']  6.78,24.54 180 top
C18  21.62,13.92 180 top
C19  24.41,16.89 270 top
C20  32.11,15.54 90 top
C21  24.41,16.02 270 top
C22  24.44,15.14 270 top
C23  21.56,16.96 180 top
C24  32.14,20.7 90 top
C25  24.43,14.26 270 top
C26  24.44,13.38 270 top
C27  10.21,6.78 90 top
C28  29.4,9.94 270 bottom
C29  9.78,20.03 270 top
C30  13.32,5.88 90 bottom
C31  29.39,6.97 270 bottom
C32  9.8,16.89 270 top
C33  1.63,18.24 0 bottom
D1  7.09,9.42 90 bottom
D2  30.99,4.69 90 top
J1  24.97,2.72 90 top
J2  34.57,9.22 90 top
J3  8.43,2.77 180 bottom
J4  35.03,17.65 90 bottom
J5  2.9,17.6 90 top
J6  2.79,11.38 270 bottom
LED1  2.03,22.1 90 bottom
MTG1  2.16,2.13 0 top
MTG2  35.69,2.13 0 top
MTG3  35.69,24.23 0 top
MTG4  2.16,24.23 0 top
OSC1  27.05,23.16 90 top
R1  15.16,24.21 180 top
R2  24.13,24.03 270 top
R3  11.94,16.89 270 top
R4  12.37,19.28 90 top
R5  19.48,19.02 270 top
R6  16.13,22.48 270 top
R7  28.79,18.77 270 bottom
R8  28.75,19.81 270 bottom
R9  21.93,11.7 90 top
R10  21.03,5.7 270 bottom
R11  20.11,11.69 90 top
R12  19.28,5.74 270 bottom
R13  18.26,11.68 90 top
R14  17.49,5.75 270 bottom
R15  18.26,10.76 90 top
R16  11.8,11.35 270 top
R17  13.59,9.16 90 top
R18  11.8,12.74 270 top
R19  11.76,9.59 90 top
R20  11.79,14.15 270 top
R21  15.53,17.19 90 top
R22  33.46,22.66 180 top
R23  35.37,20.85 180 top
R24  24.22,8.43 270 top
R25  2.24,20.27 180 bottom
S1  5.46,20.04 90 bottom
SKT1  18.92,15.18 0 bottom
TP1  26.38,1 0 top
TP2  29.78,1.04 0 top
TP3  28,1.02 0 top
U1  19.88,15.18 180 bottom
U3  6.32,22.48 270 top
U4  33.57,18.11 0 top
U5  20.9,21.89 180 top
U6  7.24,24.43 270 bottom
U7  11.56,23.85 180 top
U8  11.38,5.37 0 bottom
U9  29.41,8.46 90 bottom
U10  2.77,7.87 270 top
U11  9.83,18.53 90 top

### Tracks (layer width: path | path; a pad name or v marks a point on that pad's centre or on a via)
0
  cutout Top: 22.99,8.08 22.77,7.86 22.77,7.38 22.81,7.34 23.16,7.34 23.15,7.35 23.15,8.13 23.1,8.08 22.96,8.08 22.96,8.05 22.86,7.95
  cutout Top: 22.07,7.35 22.19,7.47 22.19,8.12 22.8,8.72 22.8,8.8 22.5,9.09 22.29,9.09 21.78,8.59 21.78,8.53 21.78,7.37 21.82,7.33 22.05,7.33 22.1,7.38
  cutout Top: 19.66,7.37 19.66,9.02 18.47,10.21 17.92,10.21 17.89,10.19 17.88,10.17 17.88,9.23 18.82,9.23 19.33,8.72 19.33,7.38 19.35,7.35 19.63,7.35 19.67,7.39
  cutout Top: 22.36,23.7 22.36,21.21 22.52,21.06 22.64,21.06 22.75,21.16 22.75,23.62 22.67,23.7
  cutout Top: 13.08,25.23 13.08,22.91 13.09,22.9 13.44,22.9 13.51,22.97 13.51,25.2 13.47,25.23 13.09,25.23
  cutout Top: 11.7,3.38 12.59,3.38 12.6,3.37 12.27,3.7 11.81,3.7 11.72,3.61 11.72,3.38 11.73,3.38
  cutout Bottom: 22.52,5.84 22.89,5.84 22.89,4.39 22.87,4.38 22.77,4.38 22.52,4.64
CAM_GPIO172  (via drill 0.26 pad 0.51)
  Top 0.152: v30.23,19.34 30.23,13.28 28.84,11.9 24.08,11.9 23.75,11.57 23.75,9.28 22.47,8.01 J1.40
  Bottom 0.152: v30.23,19.34 29.65,18.77 R7.2 29.28,18.8 29.46,18.8 29.98,18.28 31.94,18.28
  Bottom 0.203: 31.94,18.28 J4.2
CAM_GPIO173  (via drill 0.26 pad 0.51)
  Top 0.152: v28.78,21.69 28.78,19.08 v27.71,18.01 27.15,17.45 v25.93,17.45 | J1.14 16.05,6.25 16.05,5 v16.42,4.62 | v26.44,7.19 v26.44,9.91
  Bottom 0.152: J4.3 32.46,16.96 30.19,16.96 29.15,18.01 v27.71,18.01 | 28.83,21.69 29.84,20.68 29.84,19.89 29.77,19.81 R8.2 | v25.93,17.45 26.21,17.17 26.21,10.86 26.44,10.63 v26.44,9.91 | v16.42,4.62 16.42,3.41 16.8,3.03 18.21,3.03 18.74,2.5 23.95,2.5 26.43,4.98 26.43,7.18 v26.44,7.19
  Bottom 0.254: v28.78,21.69 28.83,21.69
CAM_GPIO178  (via drill 0.26 pad 0.51)
  Top 0.152: v17.68,4.01 17.5,4.01 17.47,4.04 J1.19 | v31.51,13.69 29.08,11.26 26.29,11.26 25.78,10.75 v25.78,6.68
  Bottom 0.152: v17.68,4.01 17.94,4.01 17.92,3.99 19.08,2.83 23.53,2.83 25.78,5.08 v25.78,6.68 | v31.51,13.69 31.51,15.28 32.02,15.78
  Bottom 0.203: 32.02,15.78 J4.4
CAM_PCLK  (via drill 0.26 pad 0.51)
  Top 0.152: v22.24,4.09 22.28,4.09 22.47,3.89 J1.39 22.47,1 22.81,0.66 26.03,0.66 TP1.TP | v22.77,9.12 23.2,9.56 23.2,12.27 22.33,13.15 18.62,13.15 17.94,13.82 17.94,16.83 17.58,17.19 R21.2
  Bottom 0.152: v22.24,4.09 22.24,8.59 v22.77,9.12
FRAME_VALID  (via drill 0.26 pad 0.51)
  Top 0.152: J1.4 13.44,6.28 13.44,5.32 13.31,5.2 v13.31,4.61 | v27.66,6.73 28.36,6.73 28.92,7.29 28.88,7.33 28.88,7.99 28.24,8.62 28.1,8.62 27.82,8.91 v27.82,10.41 | v27.91,2.62 28,2.53 TP3.TP
  Bottom 0.152: U1.28 22.33,21.09 22.75,21.51 24.76,21.51 27.13,19.15 27.13,15.15 27.85,14.43 27.85,10.45 v27.82,10.41 | v13.31,4.61 13.56,4.36 13.56,2.69 14.41,1.84 24.71,1.84 27.7,4.83 | v27.66,6.73 27.7,6.69 27.7,4.84 27.7,4.83 | 27.7,4.83 27.7,3.14 27.91,2.92 v27.91,2.62
GND  (via drill 0.26 pad 0.51)
  Top 0.152: 13.95,1.64 13.97,1.66 J1.5 | J1.17 16.99,2.7 16.99,1.65 16.98,1.64 13.95,1.64 | 13.95,1.64 10.8,1.64 v10.46,1.98 | J1.27 19.47,1.34 v19.39,1.26 | J1.6 13.97,7.16 13.18,7.95 13.11,8.02 12.52,8.02 12.32,8.21 10.81,8.21 10.26,8.76 v10.18,8.76
  Bottom 0.254: J3.1 10.03,4.92 U8.4
  other vias: 25.54,19.05 20.2,16.2 13.94,10.19 26.3,2.32 21.23,1.08 24.72,9.72 10.17,16.09
  pour Route15 (isolate 0.254): -0.38,26.64 -0.38,-0.53 38.23,-0.53 38.23,26.9 -0.38,26.9
  pour Bottom (isolate 0.254): -0.38,26.9 38.23,26.9 38.23,-0.53 -0.38,-0.53 -0.38,-0.28
  pour Top (isolate 0.254): -0.66,27.15 -0.66,-0.79 38.51,-0.79 38.51,27.15
I2C_SCL  (via drill 0.26 pad 0.51)
  Top 0.152: U11.3 10.66,18.73 11.14,19.2 v11.14,19.28 R4.1 | J1.7 14.49,2.74 14.49,3.95 v14.43,4.01
  Bottom 0.152: v11.14,19.28 12.65,17.77 12.61,17.73 | 12.61,17.73 10.24,15.35 10.24,10.05 10.77,9.51 13.01,9.51 14.13,8.39 14.13,8.08 14.02,7.97 14.02,7.51 14.35,7.18 14.55,7.18 14.58,7.15 14.58,4.8 14.33,4.55 14.33,4.11 v14.43,4.01 | 12.61,17.73 12.65,17.77 13.47,16.96 15.31,16.96 U1.15
I2C_SDA  (via drill 0.26 pad 0.51)
  Top 0.152: R3.1 12.55,17.04 | J1.8 14.47,7.63 v14.58,7.74 | v12.22,16.13 12.4,16.31 R3.1 | U11.2 10.76,18.33 11.02,18.59 11.62,18.59 12.55,17.65 | R3.1 12.55,17.04 | 12.55,17.04 12.55,17.65 | v13.91,17.66 13.9,17.65 12.55,17.65
  Bottom 0.152: v12.22,16.13 10.79,14.71 10.79,10.17 11,9.97 13.19,9.97 14.58,8.58 v14.58,7.74 | v13.91,17.66 15.32,17.66 U1.16
LINE_VALID  (via drill 0.26 pad 0.51)
  Top 0.152: v14.02,5.03 13.87,4.88 13.87,4.38 13.47,3.98 J1.3 | v27,10.65 27.09,10.57 v27.09,7.7 27.09,5.78 27.35,5.52 27.35,4.59 29.79,2.15 29.79,1.18 29.72,1.1
  Top 0.254: 29.72,1.1 TP2.TP
  Bottom 0.152: U1.29 23.03,21.11 24.56,21.11 26.64,19.02 26.64,14.52 26.97,14.19 26.99,14.19 27,14.17 v27,10.65 | v27.09,7.7 27.05,7.66 27.05,6.29 27.04,6.28 27.04,4.84 24.38,2.18 15.14,2.18 13.87,3.46 13.87,4.25 14.02,4.4 v14.02,5.03
N$1  (via drill 0.26 pad 0.51)
  Top 0.203: v34.07,8.59 32.71,8.59 J2.3
  Bottom 0.203: U9.6 34,8.66 v34.07,8.59
N$2  (via drill 0.26 pad 0.51)
  Top 0.152: v21.48,12.52 21.45,12.5 21.45,11.71 R9.1
  Bottom 0.152: U1.45 22.31,10.67 22.31,11.94 21.72,12.52 v21.48,12.52
N$3
  Top 0.152: J1.36 21.47,8.67 22.6,9.8 22.6,11.7 R9.2
N$4
  Bottom 0.152: U1.46 21.59,10.65 21.59,9.03 20.54,7.98 20.54,5.73 R10.1
N$5  (via drill 0.26 pad 0.51)
  Top 0.152: J1.35 21.47,4.43 v21.51,4.47
  Bottom 0.152: R10.2 21.51,5.68 v21.51,4.47
N$6  (via drill 0.26 pad 0.51)
  Top 0.152: R11.1 19.65,12.44 v19.57,12.52
  Bottom 0.152: v19.57,12.52 20.23,12.52 20.93,11.82 U1.47
N$7
  Top 0.152: J1.34 20.97,11.29 R11.2
N$8
  Bottom 0.152: R12.1 18.82,7.93 20.23,9.35 U1.48
N$9  (via drill 0.26 pad 0.51)
  Top 0.152: J1.33 20.97,3.89 v20.81,4.05
  Bottom 0.152: v20.81,4.05 19.74,5.12 R12.2
N$10  (via drill 0.26 pad 0.51)
  Top 0.152: R13.1 17.8,12.32 v18.06,12.57
  Bottom 0.152: v18.06,12.57 18.68,12.57 19.53,11.72 U1.1
N$11
  Top 0.152: J1.32 20.47,9.8 18.72,11.55 R13.2
N$12
  Bottom 0.152: R14.1 17.02,7.6 18.83,9.41 U1.2
N$13
  Bottom 0.152: U8.7 11.58,6.8 11.89,7.11 11.89,7.83 11.23,8.48 10.7,8.48 9.38,7.16 8.01,7.16 7.18,6.33 J3.3
N$14  (via drill 0.26 pad 0.51)
  Top 0.152: J1.31 20.47,3.57 v19.98,4.06 v19.98,4.08
  Bottom 0.152: v19.98,4.08 19.98,4.18 19,5.16 18.4,5.16 17.95,5.61 R14.2
N$15
  Top 0.152: U5.2 20.9,23.93 21.01,24.03 R2.2
N$16
  Top 0.152: R2.1 26.26,24.03 26.31,24.08
  Top 0.254: 26.31,24.08 OSC1.3
N$17  (via drill 0.26 pad 0.51)
  Top 0.203: v34.07,7.24 J2.2
  Bottom 0.203: U9.7 30.35,8.26 31.37,7.24 v34.07,7.24
N$18
  Bottom 0.152: U8.6 11.18,6.83 11.58,7.24 11.58,7.7 11.22,8.07 10.74,8.07 10.42,7.75 10.42,6.63 8.56,6.63 8.43,6.5 J3.2
N$19  (via drill 0.26 pad 0.51)
  Top 0.152: v12.64,4.13 12.97,3.8 J1.1
  Bottom 0.152: U8.2 11.56,4.9 11.56,4.36 11.89,4.04 12.64,4.04 v12.64,4.13
N$20  (via drill 0.26 pad 0.51)
  Top 0.152: v9.63,1.99 9.63,2.74 10.39,3.51 10.39,5.7 10.99,6.3 11.27,6.3 11.29,6.32 J1.2
  Bottom 0.152: U8.3 11.18,4.47 9.63,2.92 v9.63,1.99
N$21
  Top 0.61: C8.2 U10.4 | U10.4
N$22  (via drill 0.26 pad 0.51)
  Top 0.152: R15.1 17.2,10.15 v17.2,9.49
  Bottom 0.152: v17.2,9.49 17.82,9.49 18.14,9.81 18.13,9.82 U1.3
N$23
  Top 0.61: U4.4 R23.2 34.52,21.73 34.31,21.93 R22.1
N$24
  Top 0.152: J1.30 19.97,9.15 18.72,10.4 R15.2
N$25
  Top 0.152: R5.1 19.96,19.04 U5.4
  Top 0.254: U5.4
N$26  (via drill 0.26 pad 0.51)
  Top 0.152: R5.2 18.98,18.99 v18.98,18.19
  Bottom 0.152: v18.98,18.19 18.9,18.19 18.67,17.96 18.67,14.94 16.87,13.14 16.87,10.78 U1.5
N$27
  Bottom 0.508: S1.3 6.36,22.19
  Bottom 0.61: 6.36,22.19 U6.3 | S1.4 S1.3
N$28  (via drill 0.26 pad 0.51)
  Top 0.152: U7.2 11.54,25.13 v11.54,24.1
  Bottom 0.152: U6.2 8.75,23.47 8.99,23.72 9.5,23.72 9.74,23.47 10.91,23.47
  Bottom 0.254: 10.91,23.47 v11.54,24.1
N$29  (via drill 0.26 pad 0.51)
  Top 0.152: U7.4 9.6,22.55 v9.27,22.22
  Bottom 0.152: v9.27,22.22 9.47,22.02 9.7,22.02 13.36,18.36 14.38,18.36 U1.17
N$30
  Bottom 0.508: R25.1 1.38,21.99 LED1.A
N$31
  Top 0.152: R24.2 23.76,8.19 23.42,7.85 23.42,7.39 23.47,7.33 J1.44
N$32
  Bottom 0.152: 21.62,19.72 21.62,21.11 22.43,21.92 24.97,21.92 28.22,18.67 R7.1
  Bottom 0.203: 21.62,19.72 U1.27
N$33
  Bottom 0.152: U1.26 20.97,19.76 20.97,21.32 21.97,22.33 25.14,22.33 27.58,19.89 27.65,19.81 R8.1
N$34
  Top 0.508: D2.A 32.57,5.94 J2.1
N$35  (via drill 0.26 pad 0.51)
  Top 0.152: v17.25,4.71 17.25,4.48 16.5,3.73 16.5,2.75 J1.15
  Bottom 0.152: U9.2 26.41,8.26 25.2,7.05 25.2,5.19 23.15,3.15 19.33,3.15 17.79,4.69 17.3,4.69 17.21,4.61 17.21,4.71 v17.25,4.71
N$36  (via drill 0.26 pad 0.51)
  Top 0.152: J1.16 16.47,7.64 v16.46,7.66
  Bottom 0.152: U9.3 26.12,8.66 23.16,5.7 23.16,4.16 22.49,3.49 19.6,3.49 18.23,4.85 18.07,4.85 17.65,5.27 16.51,5.27 16.33,5.45 16.33,7.53 v16.46,7.66
N$37  (via drill 0.26 pad 0.51)
  Top 0.152: J5.2 6.81,18.23 v7.23,18.65 | U11.7 8.27,18.33 7.72,17.78 v7.72,17.47
  Bottom 0.152: v7.23,18.65 7.72,18.16 v7.72,17.47
N$38
  Top 0.152: J5.3 6.99,16.98 7.14,17.12 7.14,17.73 8.14,18.73 U11.6
N$39
  Bottom 0.508: J6.1 J6.2 5.37,10.67 D1.A
N$40  (via drill 0.26 pad 0.51)
  Top 0.152: R16.1 13.08,11.35 13.11,11.33 v13.21,11.33
  Bottom 0.152: v13.21,11.33 14.34,11.33 U1.7
N$41  (via drill 0.26 pad 0.51)
  Top 0.152: J1.29 19.97,0.82 19.81,0.66 9.31,0.66 7.69,2.27 7.69,11.79 v7.61,11.87 | v9.68,11.32 11.3,11.32 R16.2
  Bottom 0.152: v7.61,11.87 9.12,11.87 v9.68,11.32
N$42  (via drill 0.26 pad 0.51)
  Top 0.152: R17.1 13.13,9.43 12.57,9.98 12.55,10.01 12.55,10.54 v12.51,10.58
  Bottom 0.152: v12.51,10.58 12.51,11.72 12.85,12.06 14.37,12.06 U1.8
N$43
  Top 0.152: J1.26 18.99,8.61 18.67,8.93 14.28,8.93 R17.2
N$44  (via drill 0.26 pad 0.51)
  Top 0.152: R18.1 13.16,12.74 v13.18,12.76
  Bottom 0.152: v13.18,12.76 14.38,12.76 U1.9
N$45  (via drill 0.26 pad 0.51)
  Top 0.152: J1.25 18.97,1.66 18.33,1.02 9.38,1.02 8.37,2.03 8.37,12.09 8.38,12.1 8.08,12.41 v8.08,12.73 | R18.2 9.66,12.74 v9.65,12.73
  Bottom 0.152: v9.65,12.73 v8.08,12.73
N$46  (via drill 0.26 pad 0.51)
  Top 0.152: v11.43,10.6 11.3,10.47 R19.1
  Bottom 0.152: U1.10 14.42,13.46 14.41,13.45 12.29,13.45 11.43,12.59 v11.43,10.6
N$47
  Top 0.152: J1.24 18.49,6.34 18.49,8.12 18.14,8.47 12.88,8.47 12.22,9.13 R19.2
N$48  (via drill 0.26 pad 0.51)
  Top 0.152: R20.1 13.08,14.15 v13.11,14.12
  Bottom 0.152: v13.11,14.12 14.34,14.12 U1.11
N$49
  Top 0.152: R20.2 9.7,14.15 9.45,13.9 9.44,13.9 9.07,13.52 9.07,1.76 9.49,1.34 18.22,1.34 18.44,1.56 18.44,2.68 J1.23
N$52  (via drill 0.26 pad 0.51)
  Top 0.508: R6.1 17.97,22.48 v17.98,22.47
  Bottom 0.152: v17.98,22.47 19.55,20.9 19.55,19.73 U1.24
P1P8V  (via drill 0.25, 0.26 pad 0.51)
  Top 0.152: 9.32,19.19 U11.5 | 21.84,20.58 U5.5 | 12.55,22.43 12.55,22.5 U7.5 | R3.2 11.48,17.84 11.28,18.03 | 12.83,20.1 12.9,20.17 | v10.98,7.51 10.98,7.09 C27.2 | C29.2 9.32,20.44 v9,20.75 | v14.21,16.24 14.23,16.26 | 14.99,16.26 C5.2
  Top 0.203: U11.1 10.3,17.95 11.16,17.95 v11.25,18.03 11.28,18.03 | C29.2 9.32,19.19
  Top 0.254: v9.25,23.11 9.19,23.16 | C11.1 13.64,18.73 v13.64,19.58 13.64,19.81 13.28,20.17 13.03,20.17 12.9,20.17 C13.2 | C5.2 14.98,16.27 | C7.2 14.33,15 v14.21,14.88 | R4.2 12.83,20.1 | 12.6,22.48 12.55,22.43 12.43,22.3 | 14.31,22.54 14.38,22.48 | 14.99,16.26 14.23,16.26
  Top 0.305: J1.46 v23.97,7.62 v23.98,7.62
  Top 0.406: 7.42,24.54 U3.5 9.25,23.13
  Top 0.508: 9.19,23.16 C4.1 | C3.2 21.84,20.58 | 12.43,22.3 C10.2 12.46,20.98 13.33,20.98 | R6.2 14.38,22.48 12.6,22.48 | R1.2 14.31,22.54 | U5.5 23.11,20.59 23.22,20.7 23.22,23.03 v23.23,23.04 | C12.2 13.33,20.98 | 13.33,20.98 v13.32,20.99
  Top 0.61: 7.42,24.54 C17.1 | 9.25,23.13 v9.25,23.11
  Bottom 0.152: U1.14 | v10.98,7.51 10.98,7.25 10.79,7.06 10.79,5.84 U8.5 | v12.57,5.01 12.49,4.92 U8.1
  Bottom 0.203: U9.5 C28.2 | C28.2 | C28.2 29.88,9.93 v30.73,9.93 | U9.1 28.3,7.86 v28.1,7.66
  Bottom 0.254: U1.12 14.29,14.83 14.14,14.99 14.14,14.95 v14.21,14.88 | v14.21,16.24 U1.14 | v13.32,20.99 15.7,20.99 16.03,20.66 U1.19 | v13.64,19.58 14.19,19.03 U1.18
  pour Route2: 7.19,23.93 7.19,22.33 8.59,22.33 8.59,17.49 10.49,17.49 10.49,4.06 13.16,4.06 13.16,5.77 11.68,5.77 11.68,7.94 22.89,7.94 22.89,6.88 26.87,6.87 31.34,6.87 31.34,10.73 17.64,10.73 17.64,19.55 24.04,19.55 24.04,23.93
P2P8V  (via drill 0.25, 0.26 pad 0.51)
  Top 0.152: 23.28,17.02 v23.15,16.89 | 23.21,16.02 v23.11,15.92 | 23.17,15.14 v23.09,15.06 | 23.18,14.26 v23.11,14.19 | 19.5,14.84 C15.1 | 22.07,13.92 C18.1
  Top 0.254: C19.2 v23.16,16.89 v23.15,16.89 | C21.2 23.21,16.02 | C22.2 23.17,15.14 | C25.2 23.18,14.26 | C26.2 23.94,13.34 23.13,13.34 | 23.13,13.34 v23.11,13.32 | C23.1 22.01,17.02 23.28,17.02 | 19.5,14.84 19.5,14.01 C16.2 18.65,13.93 v18.56,14.03 | C18.1 22.19,13.92 22.77,13.34 23.13,13.34
  Top 0.61: 32.62,20.69 C24.2 | R22.2 | R22.2 32.64,22.68 32.64,24.04 32.63,24.05 v32.61,24.05 | U4.5 32.62,20.69 | 32.62,20.69 C24.2 | C24.2 R22.2 | R22.2
  Bottom 0.152: U1.4 17.42,10.66 17.42,12.71 17.5,12.79 17.5,12.81 17.83,13.13 17.84,13.13 18.56,13.86 v18.56,14.03
  Bottom 0.254: v23.11,13.32 23.69,12.74 24.17,12.74 U1.40 | v23.11,14.19 23.14,14.16 U1.38 | v23.09,15.06 23.29,14.85 U1.37 | v23.11,15.92 23.11,15.7 23.12,15.71 23.29,15.53 U1.36 | U1.34 24.38,16.89 v23.15,16.89
  pour Route2: 37.93,26.53 37.93,16.74 31.39,16.74 31.39,11.05 17.98,11.05 17.98,19.23 29.11,19.23 29.11,26.33
P3P3V  (via drill 0.26 pad 0.51)
  Top 0.152: U11.8 9.34,17.89 C32.2 9.34,16.65 v7.72,16.65 | 27.79,22.22 OSC1.1 | 27.79,20.56 v27.78,20.55
  Top 0.406: C14.2 7.6,21.65 U3.4
  Top 0.508: 27.79,22.22 C6.2 27.79,20.56 | OSC1.1 OSC1.4 | J5.1 7.6,19.48 | 7.6,19.48 v7.62,19.46 | 7.6,19.48 C14.2
  Top 0.61: U10.5 C9.2 | C9.2 | v3.28,11.3 3.97,11.3 4.07,11.21 C9.2
  Bottom 0.152: C30.2 12.04,5.88 U8.8 11.98,6.72 12.41,7.16 12.41,7.34 12.46,7.39 v12.46,7.45
  Bottom 0.203: U9.8 29.86,6.99 C31.2 29.88,6.94 v29.88,5.96
  Bottom 0.305: U6.4
  Bottom 0.508: U6.4 5.26,25.4 v5.23,25.38 v5.24,25.37 C1.2
  pour Route2: -0.08,26.35 -0.08,19.14 4.01,19.14 4.01,13.73 2.49,13.73 2.49,10.53 7.8,10.53 7.8,2.69 22.44,2.69 22.44,5.38 24.7,5.38 24.7,3.85 31.39,3.85 31.39,6.55 22.57,6.55 22.57,7.63 12.03,7.63 12.03,6.07 13.46,6.07 13.46,3.75 10.19,3.75 10.19,17.18 8.27,17.18 8.27,22.01 6.86,22.01 6.86,24.23 24.35,24.23 24.35,19.55 28.75,19.55 28.75,26.52 0.09,26.52
P5V  (via drill 0.26 pad 0.51)
  Top 0.305: J1.50 J1.48 24.47,5.11 24.09,4.72 v23.79,4.72
  Top 0.508: D2.C 31,3.42 v31,2.53 | U4.3 35.23,16.05 v35.23,15.66
  Top 0.61: U4.1 32.57,16.71 C20.2 32.57,14.6 v32.55,14.58 | v1.42,11.2 C2.2 1.47,10.24 1.47,8.89 U10.1 | U10.3 1.48,5.11 v1.45,5.08
  Bottom 0.508: D1.C 6.96,8.05 v6.04,8.05 | C33.1 2.79,18.24 v2.84,18.29 2.82,18.31 3,18.31 3,20.18 R25.2
  pour Route2: -0.09,18.83 3.71,18.83 3.71,14.06 2.18,14.06 2.18,10.21 7.48,10.21 7.48,2.39 22.81,2.39 22.81,5.08 24.38,5.08 24.38,3.53 31.71,3.53 31.71,16.41 37.92,16.41 37.92,-0.11 -0.09,-0.11
PIXCLK  (via drill 0.26 pad 0.51)
  Top 0.152: R21.1 14.33,17.19 13.24,16.1 13.24,15.62 v13.33,15.53
  Bottom 0.152: v13.33,15.53 U1.13
SLA_RESET_BAR  (via drill 0.26 pad 0.51)
  Top 0.152: U7.1 12.92,25.55 15.06,25.55 16.01,24.6 R1.1 16.89,24.21 v17.4,23.7 | v18.01,17.66 18.01,19.19 18.03,19.17 18.03,20.05 v17.25,20.83 | J1.13 15.97,3.74 15.86,3.85 v15.86,4.01 | v16.2,9.5 16.5,9.8 16.5,11.7 17.34,12.54 v17.34,16.5
  Bottom 0.152: v17.25,20.83 17.25,23.55 | v15.86,4.01 15.86,4.34 15.7,4.5 15.7,4.79 15.7,5.26 | v16.2,9.5 15.7,9 15.7,5.26 | 15.7,5.26 | v18.01,17.66 18.01,17.37 17.38,16.74 17.38,16.54 v17.34,16.5
  Bottom 0.254: 17.25,23.55 v17.4,23.7
STANDBY  (via drill 0.26 pad 0.51)
  Top 0.152: v15.37,9.49 15.68,9.8 15.68,13.14 v16.74,14.2 | J1.9 14.97,3.65 15.14,3.81 v15.14,4.48
  Bottom 0.152: v15.37,9.49 15.37,8.87 15.19,8.69 15.19,4.53 v15.14,4.48 | v16.74,14.2 16.74,17.22 18.12,18.61 18.12,19.71 U1.22